# Altium schematic sheet battery_controller.SchDoc: Battery Controller
size A3; Date: 2015-09-21; Author: Piotr Kuligowski; DocumentNumber: 1; Revision: 1-0; SheetNumber: 1; SheetTotal: 14; Model: EM1
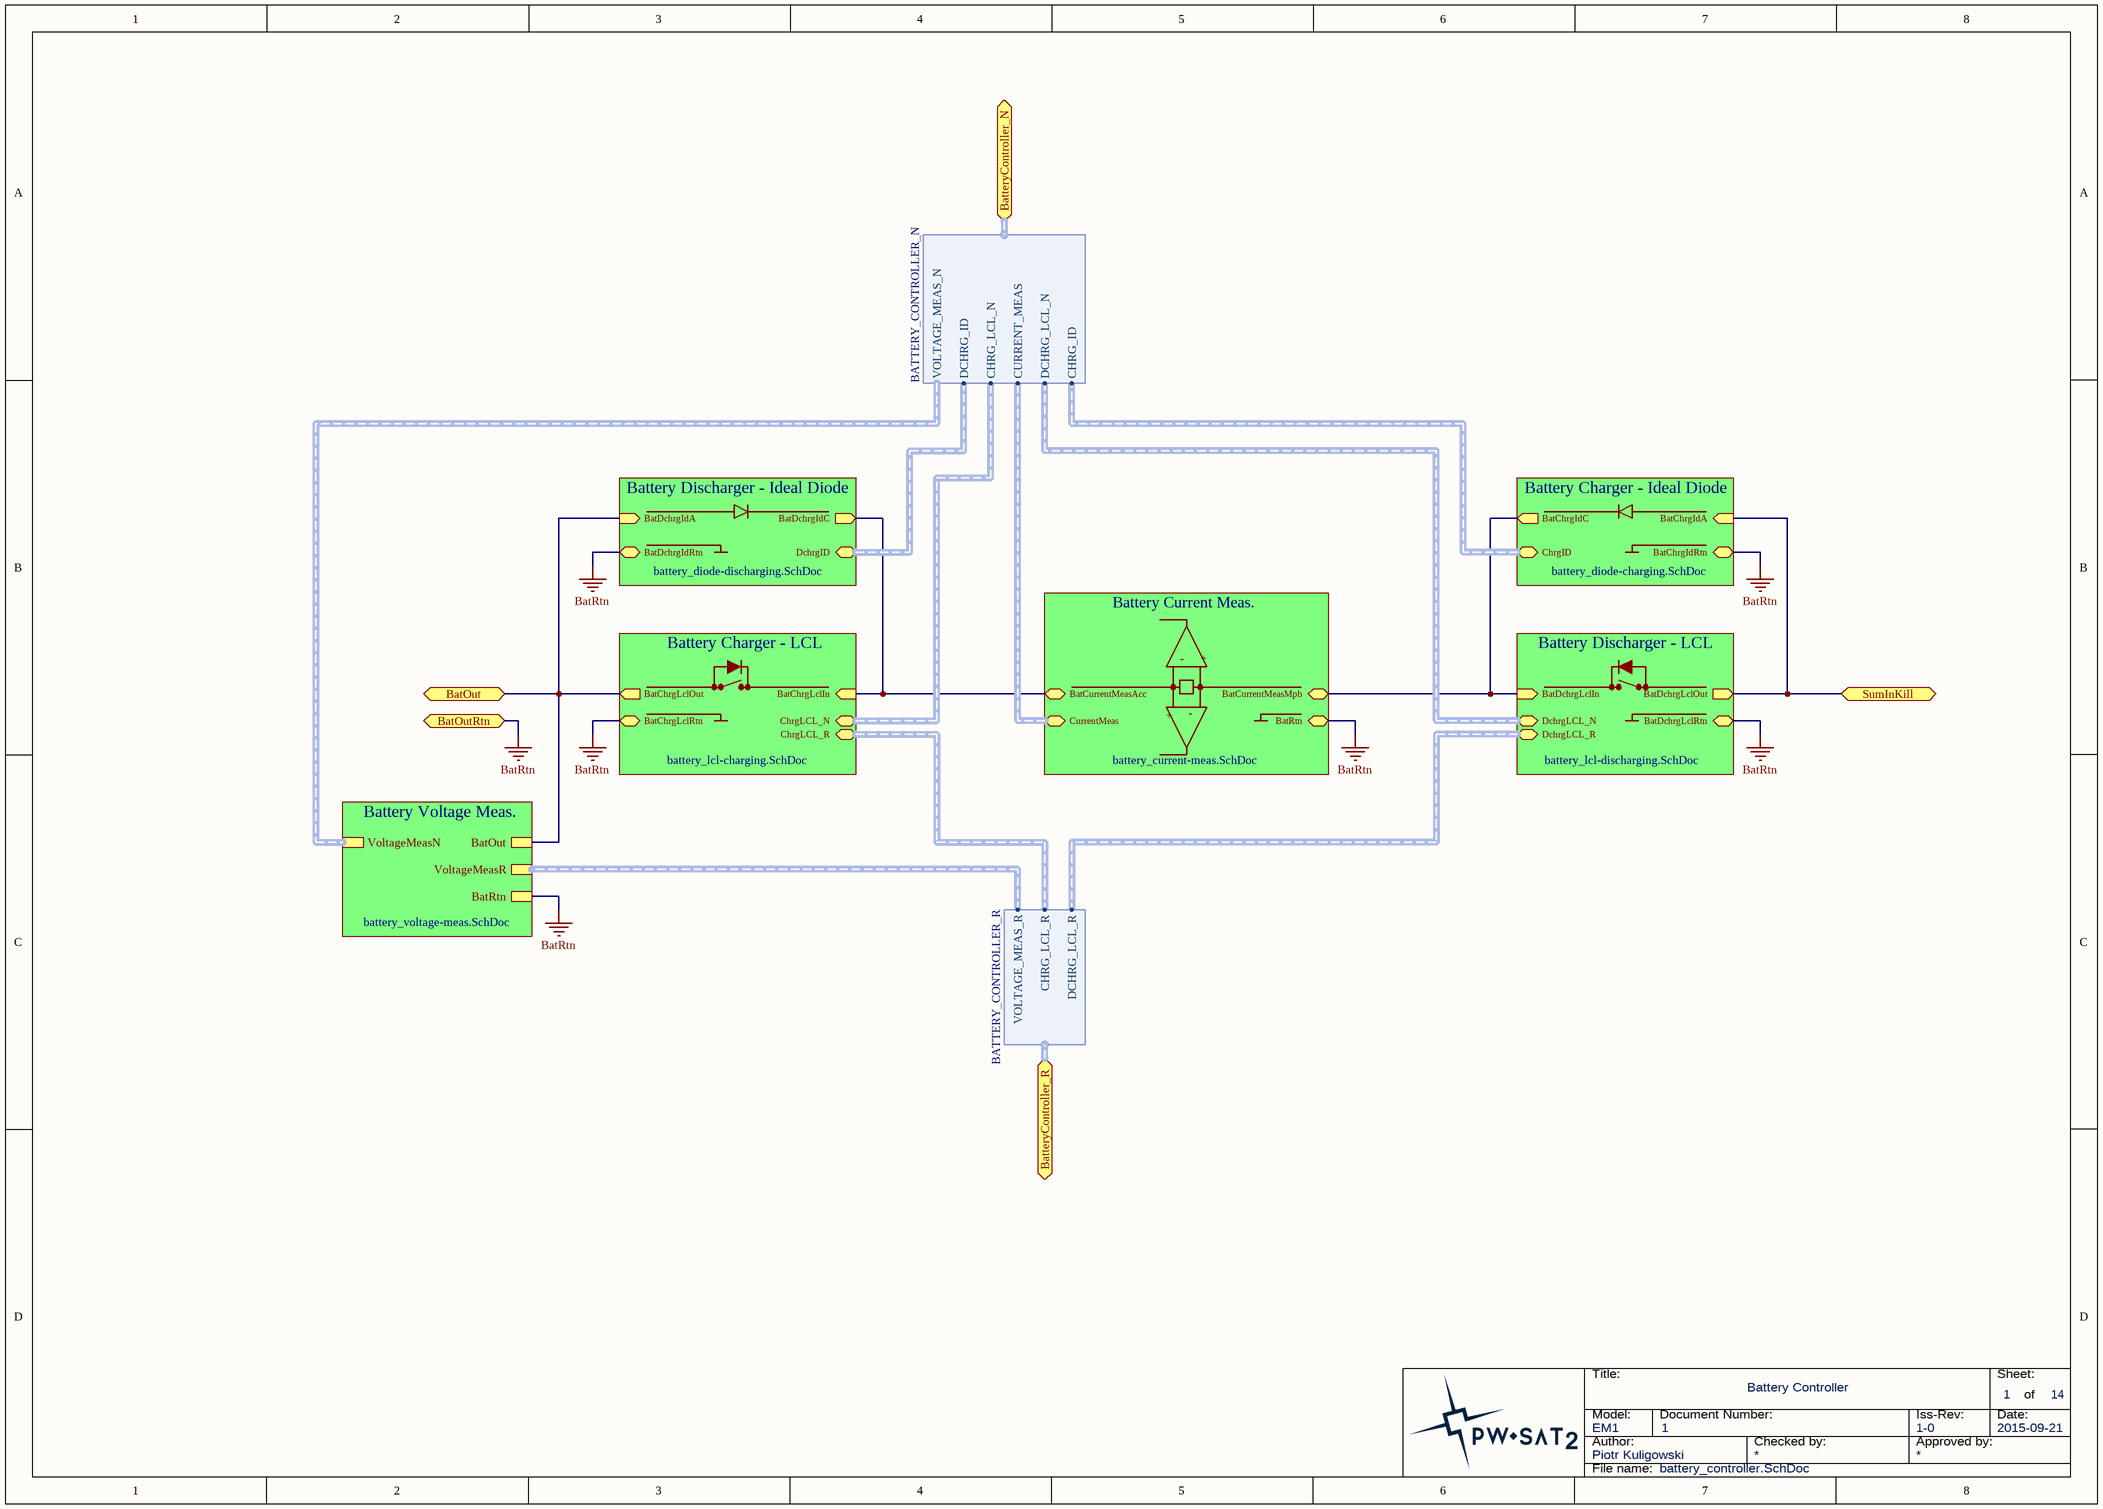
[diagram p0: battery_controller.SchDoc]

## Sub-sheets
Battery Charger - Ideal Diode = battery_diode-charging.SchDoc: BatChrgIdRtn, BatChrgIdA (in), ChrgID (harness CHRG_ID), BatChrgIdC (out)
Battery Charger - LCL = battery_lcl-charging.SchDoc: BatChrgLclIn (in), BatChrgLclRtn, BatChrgLclOut (out), ChrgLCL_N (harness CHRG_LCL_N), ChrgLCL_R (harness CHRG_LCL_R)
Battery Current Meas. = battery_current-meas.SchDoc: BatCurrentMeasMpb, BatRtn, BatCurrentMeasAcc, CurrentMeas (harness CURRENT_MEAS)
Battery Discharger - Ideal Diode = battery_diode-discharging.SchDoc: BatDchrgIdRtn, BatDchrgIdA (in), DchrgID (harness DCHRG_ID), BatDchrgIdC (out)
Battery Discharger - LCL = battery_lcl-discharging.SchDoc: BatDchrgLclIn (in), BatDchrgLclRtn, BatDchrgLclOut (out), DchrgLCL_N (harness DCHRG_LCL_N), DchrgLCL_R (harness DCHRG_LCL_R)
Battery Voltage Meas. = battery_voltage-meas.SchDoc: BatOut, VoltageMeasN (harness VOLTAGE_MEAS_N), VoltageMeasR (harness VOLTAGE_MEAS_R), BatRtn

## Ports
BatOut, BatOutRtn, BatteryController_N (harness BATTERY_CONTROLLER_N), BatteryController_R (harness BATTERY_CONTROLLER_R), SumInKill

## Harnesses
BATTERY_CONTROLLER_N: DCHRG_ID, CHRG_LCL_N, CURRENT_MEAS, DCHRG_LCL_N, CHRG_ID, VOLTAGE_MEAS_N
BATTERY_CONTROLLER_R: DCHRG_LCL_R, CHRG_LCL_R, VOLTAGE_MEAS_R

## Nets
BatRtn: port BatOutRtn, sheet Battery Current Meas./BatRtn, sheet Battery Charger - Ideal Diode/BatChrgIdRtn, sheet Battery Discharger - Ideal Diode/BatDchrgIdRtn, sheet Battery Charger - LCL/BatChrgLclRtn, sheet Battery Discharger - LCL/BatDchrgLclRtn, sheet Battery Voltage Meas./BatRtn
BatOut: port BatOut, sheet Battery Discharger - Ideal Diode/BatDchrgIdA, sheet Battery Charger - LCL/BatChrgLclOut, sheet Battery Voltage Meas./BatOut
SumInKill: port SumInKill, sheet Battery Charger - Ideal Diode/BatChrgIdA, sheet Battery Discharger - LCL/BatDchrgLclOut
(unnamed): sheet Battery Current Meas./BatCurrentMeasMpb, sheet Battery Charger - Ideal Diode/BatChrgIdC, sheet Battery Discharger - LCL/BatDchrgLclIn
(unnamed): sheet Battery Current Meas./BatCurrentMeasAcc, sheet Battery Discharger - Ideal Diode/BatDchrgIdC, sheet Battery Charger - LCL/BatChrgLclIn

## Notes on the sheet
- +
- -
- Title:
- Sheet:
- of
- Author:
- Model:
- Document Number:
- Checked by:
- Iss-Rev:
- Approved by:
- Date:
- File name: